# Altium schematic sheet Block Diagram.SchDoc
size A4; Programme: Formation Altium Designer; Designer: Zeineb El Arbi; Organization: ORGANIZATION; Address1: ADDRESS 1; Address2: ADDRESS 2; Address3: ADDRESS 3; Address4: ADDRESS 4; Revision: -; ENG_APP_DATE: --/--/--; DSN_APP_DATE: --/--/--; CHK_APP_DATE: --/--/--
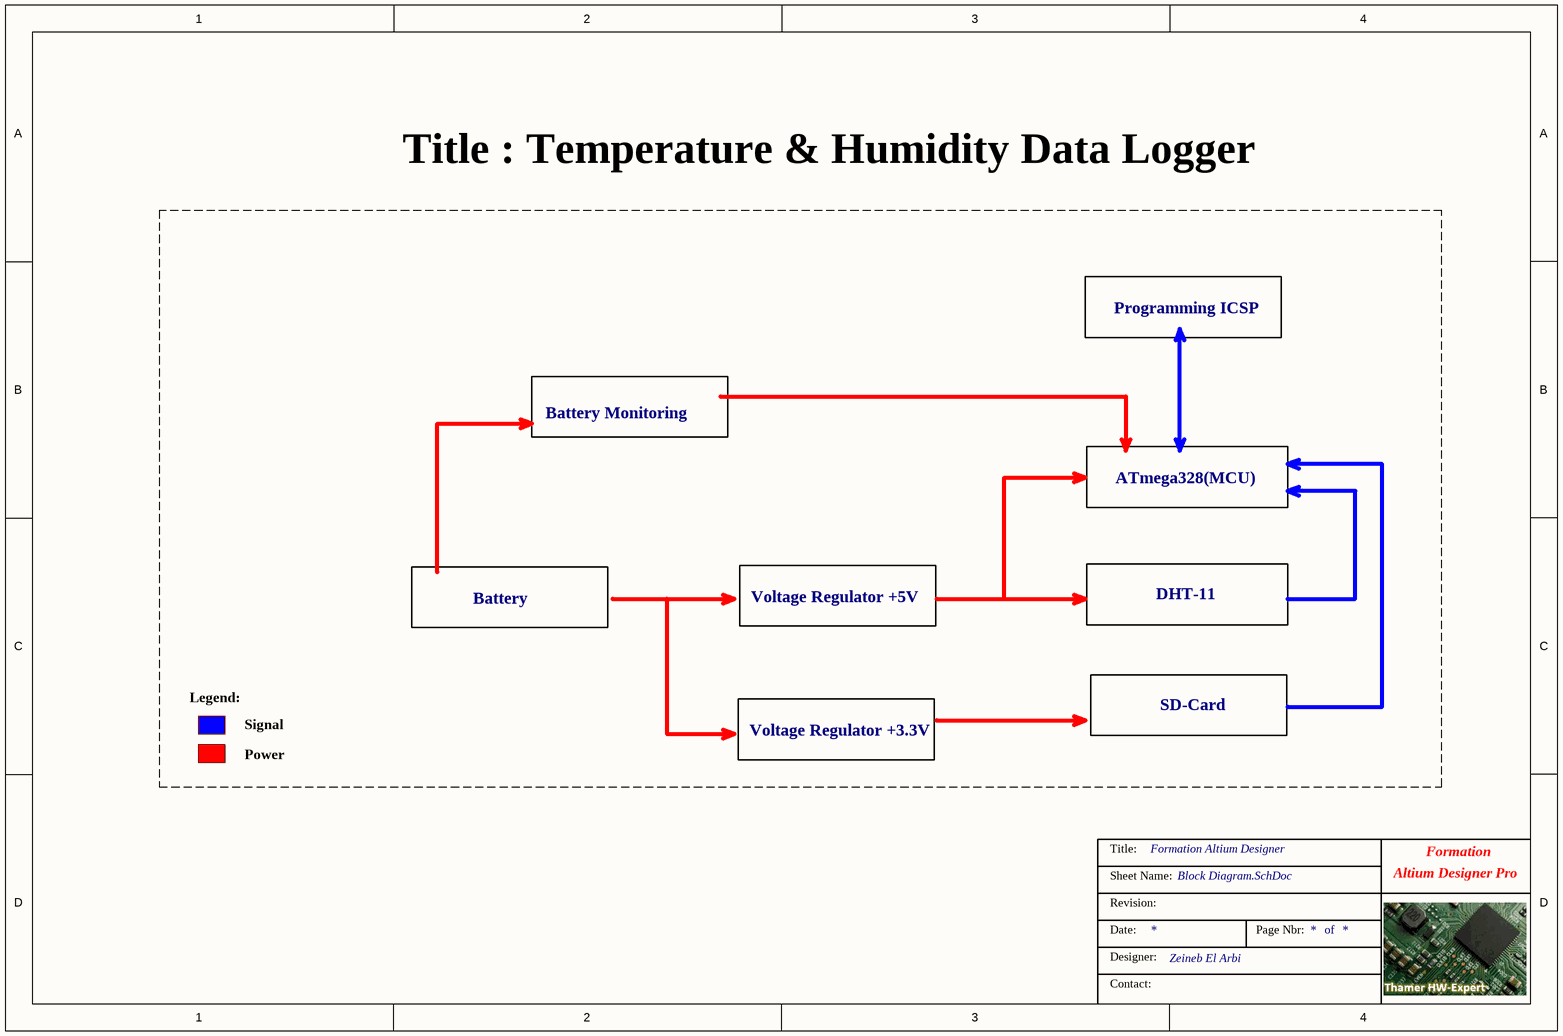
[diagram p0: Block Diagram.SchDoc]

## Notes on the sheet
- Title : Temperature & Humidity Data Logger
- Programming ICSP
- Battery Monitoring
- ATmega328(MCU)
- Battery
- Voltage Regulator +5V
- DHT-11
- Legend:
- SD-Card
- Signal
- Power
- Voltage Regulator +3.3V
- Title:
- Formation
- Sheet Name:
- Revision:
- Altium Designer Pro
- Date:
- Designer:
- Contact:
- Page Nbr:
- of